# EAGLE schematic tutorial (EAGLE 7.4.0)
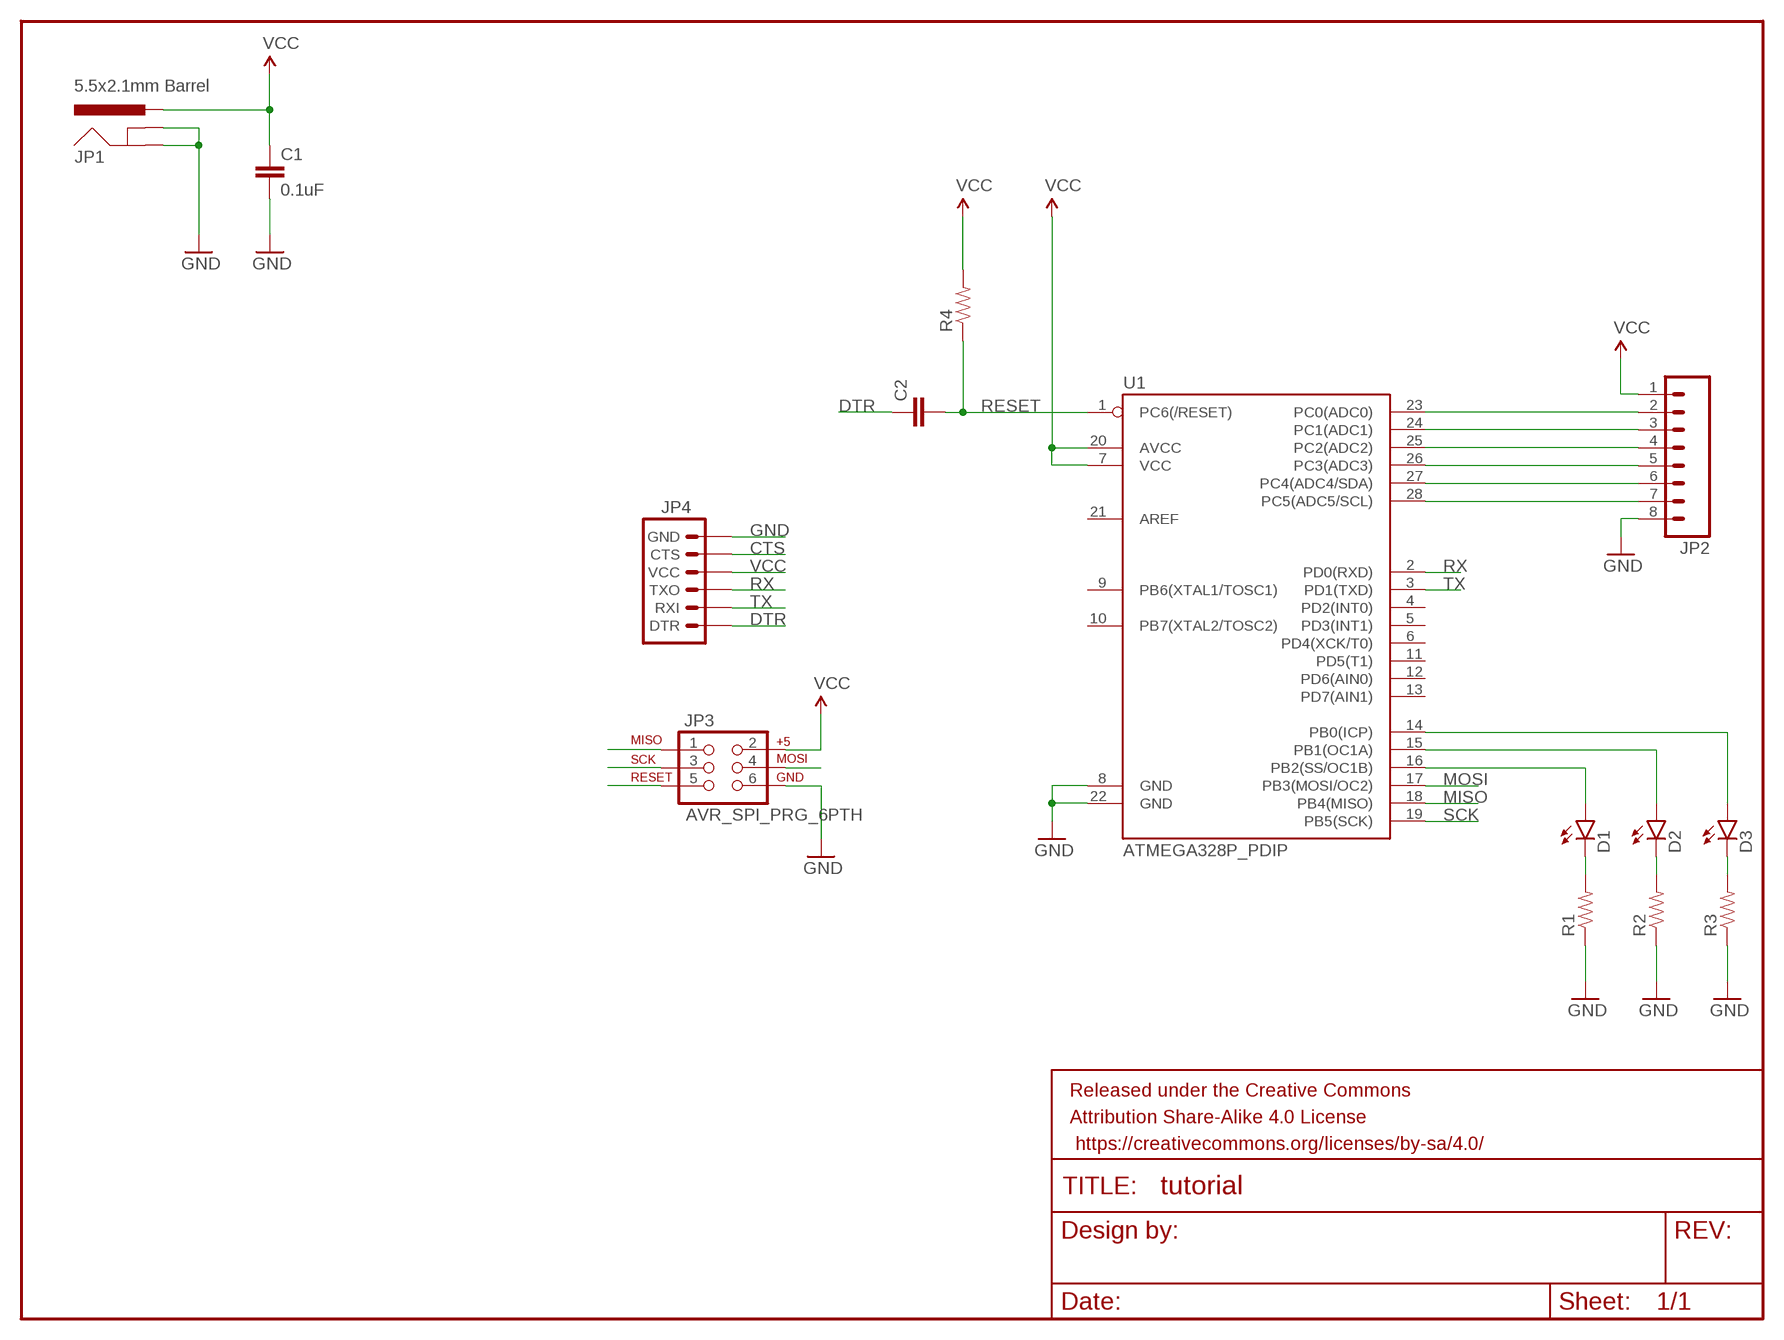
[diagram p0: schematic, sheet 1]

## Parts
C1  0.1uF  CAPPTH  [CAP-PTH-SMALL]
C2  CAPPTH  [CAP-PTH-SMALL]
D1  LED5MM  [LED5MM]
D2  LED5MM  [LED5MM]
D3  LED5MM  [LED5MM]
FRAME1  FRAME-LETTER  [CREATIVE_COMMONS]
JP1  5.5x2.1mm Barrel  POWER_JACKSMD  [POWER_JACK_SMD]
JP2  M08  [1X08_ROUND]
JP3  AVR_SPI_PRG_6PTH  [2X3]
JP4  ARDUINO_SERIAL_PROGRAMPTH  [1X06]
R1  RESISTORPTH-1/4W  [AXIAL-0.4]
R2  RESISTORPTH-1/4W  [AXIAL-0.4]
R3  RESISTORPTH-1/4W  [AXIAL-0.4]
R4  RESISTORPTH-1/4W  [AXIAL-0.4]
U1  ATMEGA328P_PDIP  [DIL28-3]

## Nets
CTS: JP4.5(CTS)
DTR: C2.1 JP4.1(DTR)
GND: C1.2 JP1.GND(GNDBREAK) JP1.P$4(GND) JP2.8 JP3.6 JP4.6(GND) R1.P$1 R2.P$1 R3.P$1 U1.8(GND) U1.22(GND)
MISO: JP3.1 U1.18(PB4(MISO))
MOSI: JP3.4 U1.17(PB3(MOSI/OC2))
N$2: JP2.2 U1.23(PC0(ADC0))
N$3: JP2.3 U1.24(PC1(ADC1))
N$4: JP2.4 U1.25(PC2(ADC2))
N$5: JP2.5 U1.26(PC3(ADC3))
N$6: JP2.6 U1.27(PC4(ADC4/SDA))
N$7: JP2.7 U1.28(PC5(ADC5/SCL))
N$8: D3.A U1.14(PB0(ICP))
N$9: D2.A U1.15(PB1(OC1A))
N$10: D1.A U1.16(PB2(SS/OC1B))
N$11: D1.K(C) R1.P$2
N$12: D2.K(C) R2.P$2
N$13: D3.K(C) R3.P$2
RESET: C2.2 JP3.5 R4.P$1 U1.1(PC6(/RESET))
RX: JP4.3(TXO) U1.2(PD0(RXD))
SCK: JP3.3 U1.19(PB5(SCK))
TX: JP4.2(RXI) U1.3(PD1(TXD))
VCC: C1.1 JP1.VIN0(PWR) JP2.1 JP3.2 JP4.4(VCC) R4.P$2 U1.7(VCC) U1.20(AVCC)
Unconnected: U1.4(PD2(INT0)) U1.5(PD3(INT1)) U1.6(PD4(XCK/T0)) U1.9(PB6(XTAL1/TOSC1)) U1.10(PB7(XTAL2/TOSC2)) U1.11(PD5(T1)) U1.12(PD6(AIN0)) U1.13(PD7(AIN1)) U1.21(AREF)

## Library data of the parts
C1 C2 = SparkFun-Capacitors:CAP: Capacitor Standard 0603 ceramic capacitor, and 0.1" leaded capacitor.
D1-D3 = SparkFun-LED:LED: LEDs Standard schematic elements and footprints for 5mm, 3mm, 1206, and 0603 sized LEDs. 5mm - Spark Fun Electronics SKU : COM-00529 (and others)
FRAME1 = SparkFun-Aesthetics:FRAME-LETTER: Schematic Frame Standard 8.5x11 US Letter frame
JP1 = SparkFun-Connectors:POWER_JACK: Power Jack This is the standard 5.5mm barrel jack for power. The PTH is the most common, proven, reliable, footprint. The Slot footprint only works if the mill layer is transmitted to the PCB fab house so be warned. Mating wall wart : TOL-00298 (and others); PROD_ID: CONN-08106; SF_ID: PRT-12748
JP2 = SparkFun-Connectors:M08: Header 8 Standard 8-pin 0.1" header. Use with straight break away headers (SKU : PRT-00116), right angle break away headers (PRT-00553), swiss pins (PRT-00743), machine pins (PRT-00117), and female headers (PRT-00115).
JP3 = SparkFun-Connectors:AVR_SPI_PRG_6: AVR ISP 6 Pin This is the reduced ISP connector for AVR programming. Common on Arduino. This footprint will take up less PCB space and can be used with a 10-pin to 6-pin adapter such as SKU: BOB-08508 **Special note about "TEST_POINT" package. The stop mask is on the top side, so if you want your programming test points to be on the bottom of your board, make sure to place this package on the bottom side of the board. This also ensure that the orientation to program from the bottom side will be correct.
JP4 = SparkFun-Connectors:ARDUINO_SERIAL_PROGRAM: FTDI connector footprints
R1-R4 = SparkFun-Passives:RESISTOR: Resistor Basic schematic elements and footprints for 0603, 1206, and PTH resistors.
U1 = SparkFun-DigitalIC:ATMEGA328P_PDIP: uC used in the Arduino 32kb flash, 1k EEPROM, 2k SRAM This is the through-hole version of this chip.